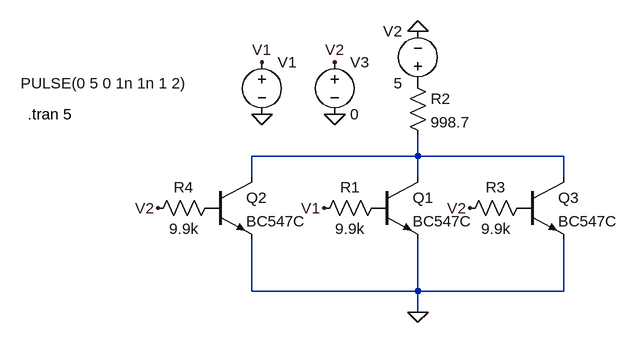
[diagram p0: schematic NOR.asc]
NOR.asc, the LTspice schematic file:
Version 4.1
SHEET 1 1344 680
WIRE 304 96 304 64
WIRE 304 96 48 96
WIRE 528 96 304 96
WIRE 48 128 48 96
WIRE 304 128 304 96
WIRE 528 128 528 96
WIRE 48 304 48 224
WIRE 304 304 304 224
WIRE 304 304 48 304
WIRE 528 304 528 224
WIRE 528 304 304 304
WIRE 304 336 304 304
FLAG 304 -96 0
FLAG 160 176 V1
FLAG 64 -48 V1
FLAG 384 176 V2
FLAG -96 176 V2
FLAG 304 336 0
FLAG 176 -48 V2
FLAG 64 32 0
FLAG 176 32 0
SYMBOL voltage 64 -64 R0
WINDOW 3 -371 48 Left 2
WINDOW 123 0 0 Left 0
WINDOW 39 0 0 Left 0
SYMATTR Value PULSE(0 5 0 1n 1n 1 2)
SYMATTR InstName V1
SYMBOL voltage 304 0 R180
WINDOW 0 24 96 Left 2
WINDOW 3 24 16 Left 2
WINDOW 123 0 0 Left 0
WINDOW 39 0 0 Left 0
SYMATTR InstName V2
SYMATTR Value 5
SYMBOL res 256 160 R90
WINDOW 0 0 56 VBottom 2
WINDOW 3 32 56 VTop 2
SYMATTR InstName R1
SYMATTR Value 9.9k
SYMBOL res 288 -32 R0
SYMATTR InstName R2
SYMATTR Value 998.7
SYMBOL npn2 240 128 R0
SYMATTR InstName Q1
SYMATTR Value BC547C
SYMBOL npn2 -16 128 R0
SYMATTR InstName Q2
SYMATTR Value BC547C
SYMBOL npn2 464 128 R0
SYMATTR InstName Q3
SYMATTR Value BC547C
SYMBOL res 480 160 R90
WINDOW 0 0 56 VBottom 2
WINDOW 3 32 56 VTop 2
SYMATTR InstName R3
SYMATTR Value 9.9k
SYMBOL res 0 160 R90
WINDOW 0 0 56 VBottom 2
WINDOW 3 32 56 VTop 2
SYMATTR InstName R4
SYMATTR Value 9.9k
SYMBOL voltage 176 -64 R0
WINDOW 123 0 0 Left 0
WINDOW 39 0 0 Left 0
SYMATTR InstName V3
SYMATTR Value 0
TEXT -296 32 Left 2 !.tran 5

The netlist it stands for:
* NOR.asc
V1 V1 0 PULSE(0 5 0 1n 1n 1 2)
V2 P001 0 5
R1 P002 V1 9.9k
R2 P001 N001 998.7
Q1 N001 P002 0 0 BC547C
Q2 N001 P003 0 0 BC547C
Q3 N001 P004 0 0 BC547C
R3 P004 V2 9.9k
R4 P003 V2 9.9k
V3 V2 0 0
.model NPN NPN
.model PNP PNP
.lib standard.bjt
.tran 5
.backanno
.end